# EasyEDA Pro project ProPrj_Dactyl Manuform 飞线轴板-V2.1_2024-11-05.epro

# Schematic Schematic1
Board Name: Board_单轴体; Create Date: 2024-09-29; Page Name: P1; Project Name: Dactyl Manuform 飞线轴板-V2.0; Schematic Name: Schematic1; Update Date: 2024-10-13; Company: 嘉立创EDA; Page Size: A4; Version: V1.0
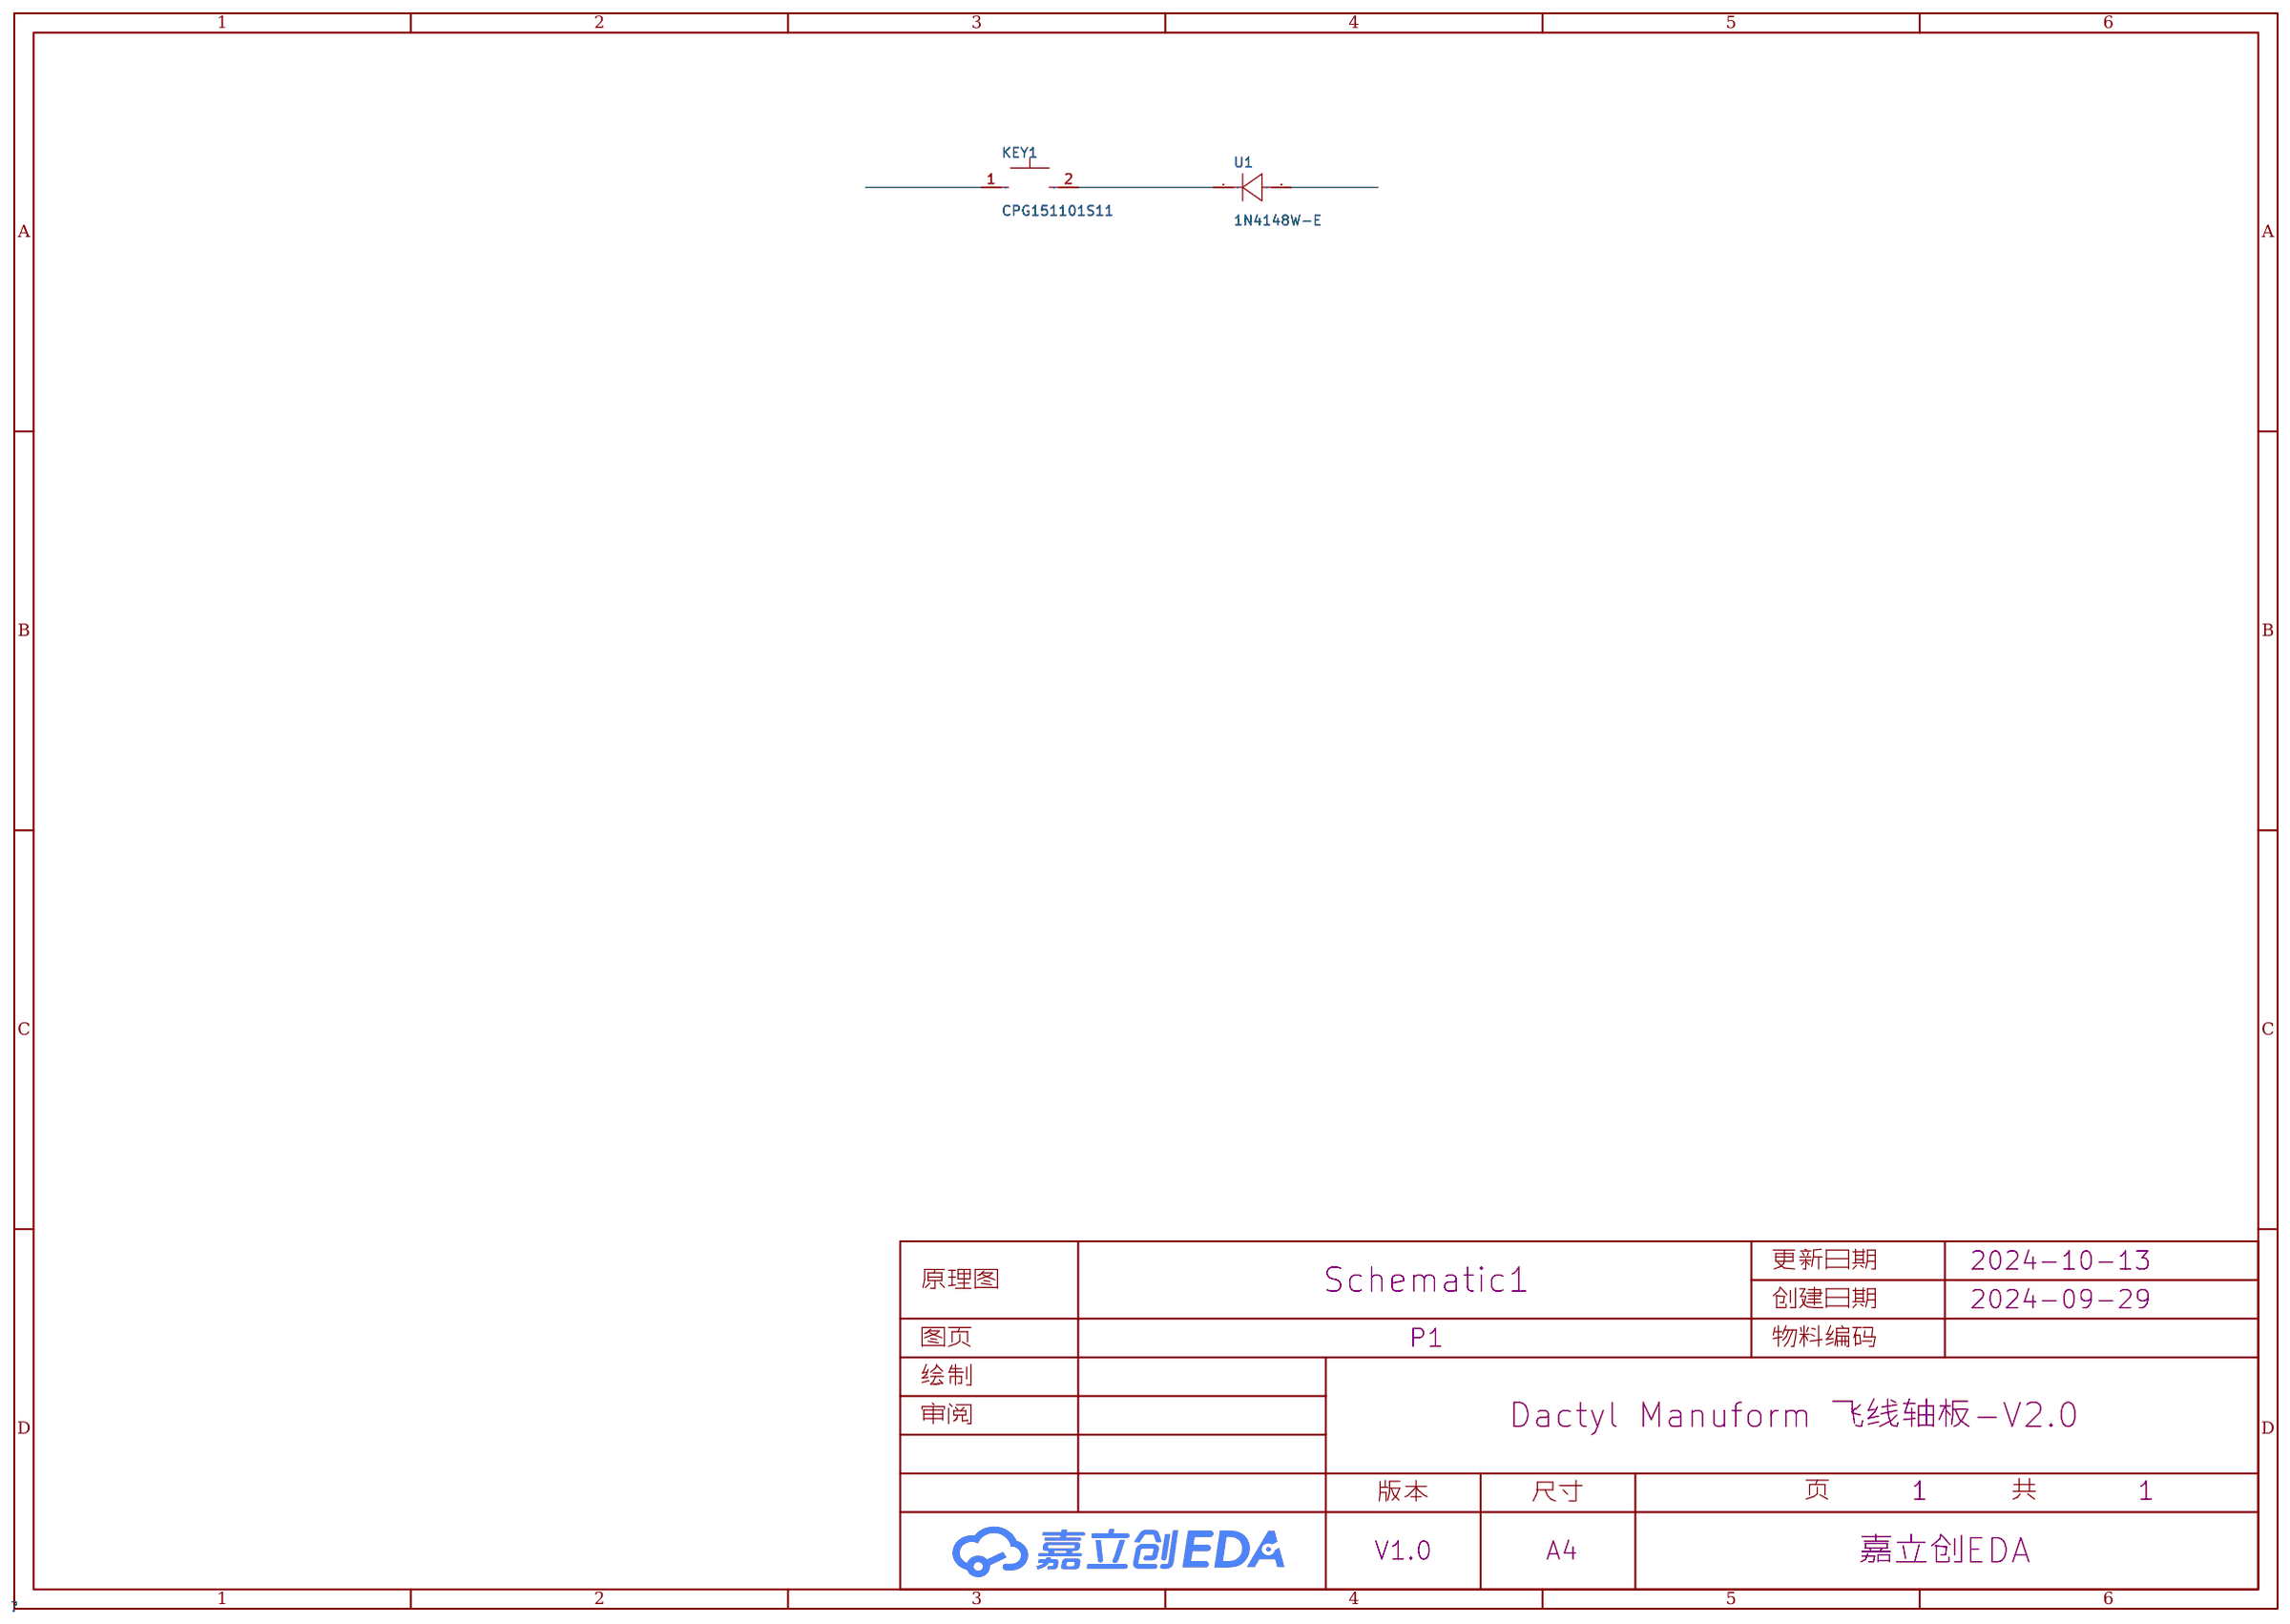
[diagram p0: schematic sheet]

## Parts
KEY1  CPG151101S11  [TH_L10.9-W5.9-CPG151101S11]
U1  1N4148W-E  [SOD-123_L2.8-W1.6-LS3.7-RD]

## Library data of the parts
KEY1 = CPG151101S11: 轴类型:-;工作电压:2V~12V;针脚数:-;操作力:-;; LCSC Part Name: 键盘轴连接器 停产; Supplier Part: C2803348; Manufacturer: Kailh(凯华); Supplier Footprint: SMD; JLCPCB Part Class: 扩展库; Datasheet: https://atta.szlcsc.com/upload/public/pdf/source/20220228/B04A6FE76F6176D3365CC186B3035FED.pdf; Supplier: LCSC; Operating Voltage: 2V~12V
U1 = 1N4148W-E: 二极管配置:-;正向压降(Vf):-;直流反向耐压(Vr):-;; LCSC Part Name: 开关二极管; Supplier Part: C41371420; Manufacturer: MDD(辰达半导体); Supplier Footprint: SOD-123; Datasheet: https://atta.szlcsc.com/upload/public/pdf/source/20240830/DACFAB1CEFECD76C0C0B0085B83E27DC.pdf; Supplier: LCSC

## Nets
Net-(KEY1-2): KEY1.2 U1.1(K)

Not connected (* = marked no-connect by the designer): KEY1 1; U1 2(A)

# Board PCB_单轴体
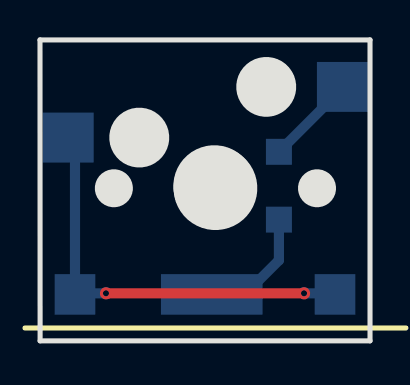
[diagram p1: board, top side]
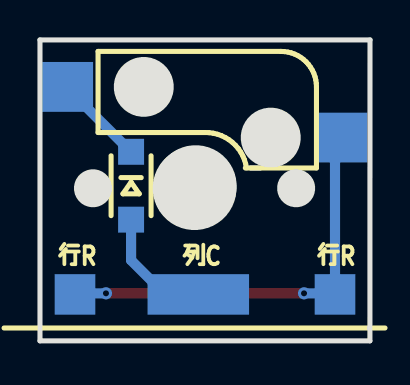
[diagram p2: board, bottom side, seen from below]

Outline 16.51 x 15.08 mm; copper layers: Top Layer, Bottom Layer. Coordinates in mm from the lower left corner of the outline.
Outline path: 0,15.08 0.01,0 16.51,0 16.51,15.08 0,15.08
Stack: Top Layer 0.035mm / Dielectric1 1.51mm FR4 er 4.5 / Bottom Layer 0.035mm

## Design rules (mm)
spacing Default (default): track to track 0.152, other pairs 0 to 0.152
track width Default (default): min 0.254, default 0.254, max 25.4
differential pair differentialPair (default): width min 0.127, default 0.254, max 2.54; gap min 0.152, default 0.152
via Default (default): diameter min 0.61, default 0.61, max 100.025; hole min 0.305, default 0.305, max 59.995

## Placement (name value [footprint] x y rotation side)
D2  1N4148W  [SOD-123FL_L2.6-W1.6-LS3.4-RD]  11.95 7.77 90 bottom
NOREF  -  [Pad_e6]  14.75 2.33 90 top
NOREF#2  -  [Pad_e8]  8.59 2.33 90 top
NOREF#3  -  [Pad_e5]  1.75 2.33 90 top
U46  凯华KAILH热插拔底座 COPY COPY  [凯华KAILH热插拔底座]  8.77 7.65 180 top

## Footprints (pads in the part's own frame, mm; a bottom-side part is the same pattern mirrored in y, then rotated)
Pad_e5
  rect 2.032x2.032 smd far side: 2(0,0)
Pad_e6
  rect 2.032x2.032 smd far side: 2(0,0)
Pad_e8
  rect 2.032x5.08 smd far side: 2(0,0)
SOD-123FL_L2.6-W1.6-LS3.4-RD
  rect 1.3x1.3 smd: 1(1.7,0) 2(-1.7,0)
凯华KAILH热插拔底座
  rect 2.55x2.5 smd far side: 1(-6.35,-5.08) 2(7.366,-2.54)

## Nets
COL: D2.1 D2.2 NOREF#2.2 U46.1
ROW: NOREF.2 NOREF#3.2 U46.2

## Via types
v1: diameter 0.61, hole 0.305, Top Layer to Bottom Layer, 2 vias

## Routing (per net, layer and track width the routed paths; a pad name or vN(x,y) marks a point on that pad's centre or on a via; arc(x,y) is an arc through that point)
COL: length 10.7
  Bottom Layer w0.508: D2.2 11.95,4.04 10.24,2.33 NOREF#2.2 ; U46.1 15.12,12.65 D2.1
ROW: length 21
  Top Layer w0.508: v1(3.3,2.38) v1(13.21,2.38)
  Bottom Layer w0.508: U46.2 1.75,9.85 1.75,2.38 v1(3.3,2.38) ; v1(13.21,2.38) 14.75,2.38

## Text on the board
Bottom Silkscreen Layer: 列C | 行R
Document Layer: X轴方向，两边各向外扩展了10mil，以使边长大于1.5cm。减少额外的V割费用 | V2.1
